# EAGLE schematic rxSD (EAGLE 9.1.3)
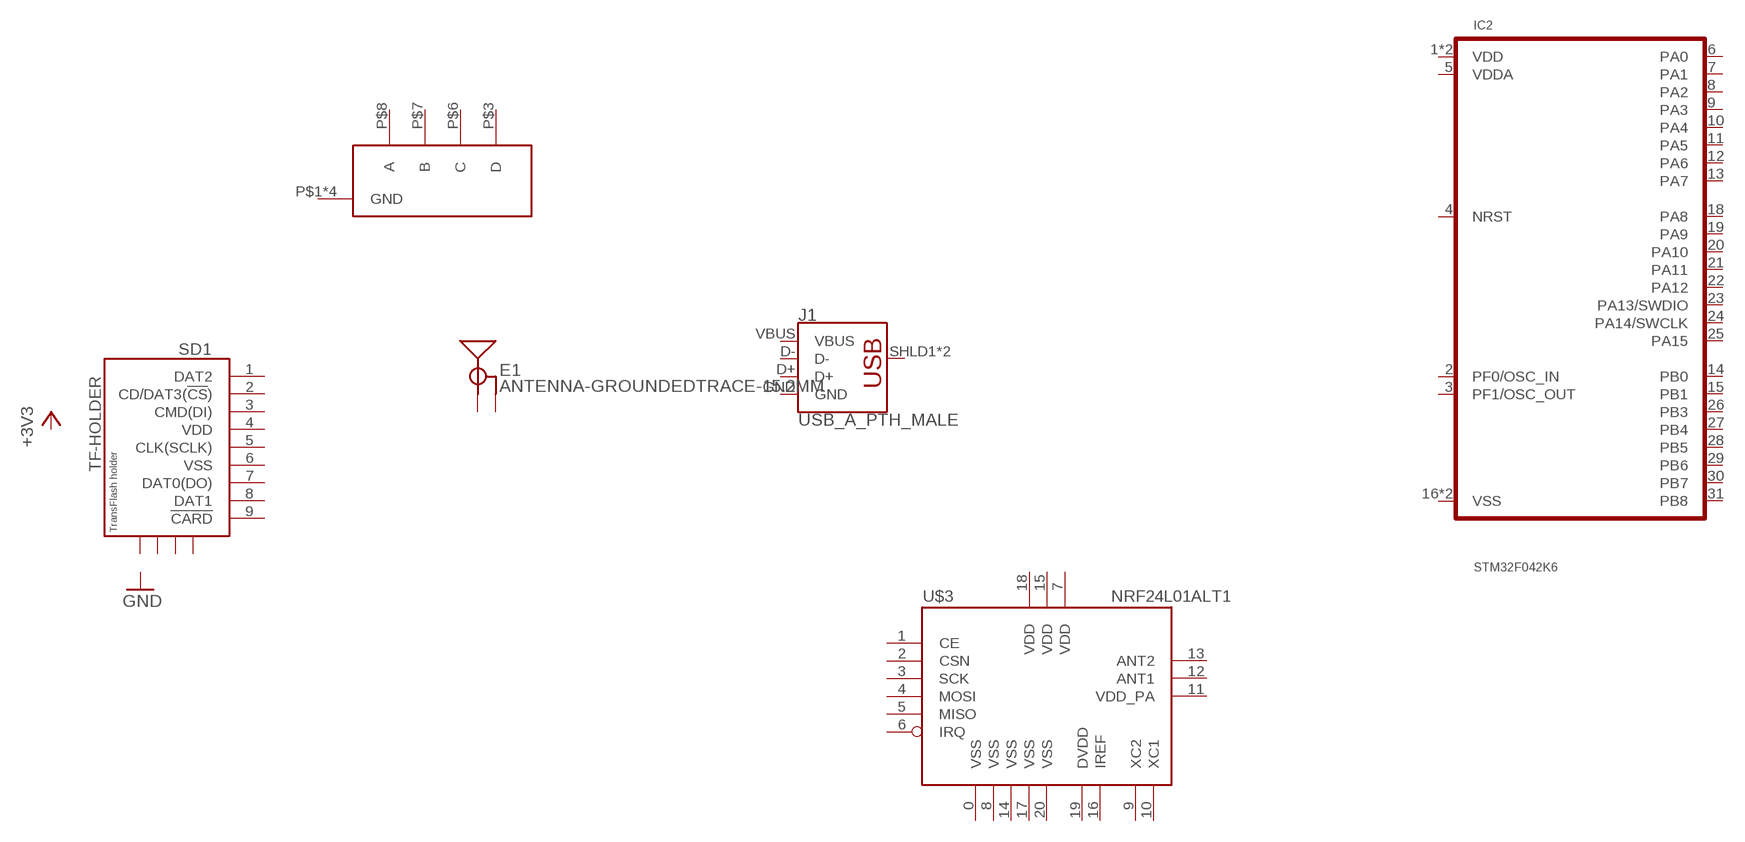
[diagram p0: schematic, sheet 1]

## Parts
E1  ANTENNA-GROUNDEDTRACE-15.2MM  [TRACE_ANTENNA_2.4GHZ_15.2MM]
IC2  STM32F042K6  [TQFP32-08]
J1  USB_A_PTH_MALE  [USB-A-H]
SD1  TF-HOLDER  [TF-PULL]
U$1  SW_3POS_DEVSW_3POS_OFFICIAL  [SW_3POS_FOOT_OFFICIAL]
U$3  NRF24L01ALT1  [QFN20_ALT1]
Unconnected: E1.ANT(SIGNAL) E1.GND IC2.1(VDD) IC2.2(PF0/OSC_IN) IC2.3(PF1/OSC_OUT) IC2.4(NRST) IC2.5(VDDA) IC2.6(PA0) IC2.7(PA1) IC2.8(PA2) IC2.9(PA3) IC2.10(PA4) IC2.11(PA5) IC2.12(PA6) IC2.13(PA7) IC2.14(PB0) IC2.15(PB1) IC2.16(VSS) IC2.17(VDD) IC2.18(PA8) IC2.19(PA9) IC2.20(PA10) IC2.21(PA11) IC2.22(PA12) IC2.23(PA13/SWDIO) IC2.24(PA14/SWCLK) IC2.25(PA15) IC2.26(PB3) IC2.27(PB4) IC2.28(PB5) IC2.29(PB6) IC2.30(PB7) IC2.31(PB8) IC2.32(VSS) J1.D+ J1.D- J1.SHLD1(SHIELD) J1.SHLD2(SHIELD) SD1.1(DAT2) SD1.2(CD/DAT3(!CS!)) SD1.3(CMD(DI)) SD1.5(CLK(SCLK)) SD1.7(DAT0(DO)) SD1.8(DAT1) SD1.9(!CARD) SD1.S1 SD1.S2 SD1.S3 SD1.S4 U$1.P$1(GND) U$1.P$2(GND) U$1.P$3(D) U$1.P$4(GND) U$1.P$5(GND) U$1.P$6(C) U$1.P$7(B) U$1.P$8(A) U$3.1(CE) U$3.2(CSN) U$3.3(SCK) U$3.4(MOSI) U$3.5(MISO) U$3.6(IRQ) U$3.9(XC2) U$3.10(XC1) U$3.12(ANT1) U$3.13(ANT2) U$3.16(IREF)

## Power pins joined to a net without a drawn wire
DVDD: U$3.19(DVDD)
GND: J1.GND
VBUS: J1.VBUS
VDD: SD1.4(VDD) U$3.7(VDD) U$3.15(VDD) U$3.18(VDD)
VDD_PA: U$3.11(VDD_PA)
VSS: SD1.6(VSS) U$3.0(VSS) U$3.8(VSS) U$3.14(VSS) U$3.17(VSS) U$3.20(VSS)

## Library data of the parts
E1 = SparkFun-RF:ANTENNA-GROUNDED: Antenna w/ Ground Connection 2.4GHz antennae with signal and ground terminals. TRACE_ANTENNA_2.4GHZ_15.2MM - Meander Trace antenna 15.2 x 5.7mm footprint Based on layout from TI app note AN043 <http://www.ti.com/lit/an/swra117d/swra117d.pdf>. TRACE_ANTENNA_2.4GHZ_25.7MM - Inverted F trace antenna 25.7 x 7.5 mm footprint. Based on layout from TI design note DN0007 <http://www.ti.com/lit/an/swru120b/swru120b.pdf>.
IC2 = nixx:STM32F042K6
J1 = SparkFun-Connectors:USB_A: USB-A Connector Male and female variants, as well as PTH and SMT variants SparkFun Products: SparkFun XBee Explorer Dongle <https://www.sparkfun.com/products/11697> PTH Male SparkFun MicroView-USB Programmer <https://www.sparkfun.com/products/12924> SMT Male SparkFun USB Type A Female Breakout <https://www.sparkfun.com/products/12700> SMT Female; PROD_ID: CONN-08367; SF_ID: PRT-00437
SD1 = clock:TF-HOLDER: TF / Micro SD socket is PUSH-PUSH type, the card can be pushed into and auto locked and pushed out by simply press the card. Surface Mounting type.
U$1 = 3pos_slide_switch:SW_3POS_DEV
U$3 = nRF24L01-Chip-v13:NRF24L01: 2.4GHz Low Power Transceiver This is the very popular, low cost, very low power RF transceiver from Nordic Semiconductor. Simple SPI interface. SKU: COM-00690